# EAGLE design Adapter-TenX-Direct (EAGLE 7.7.0)
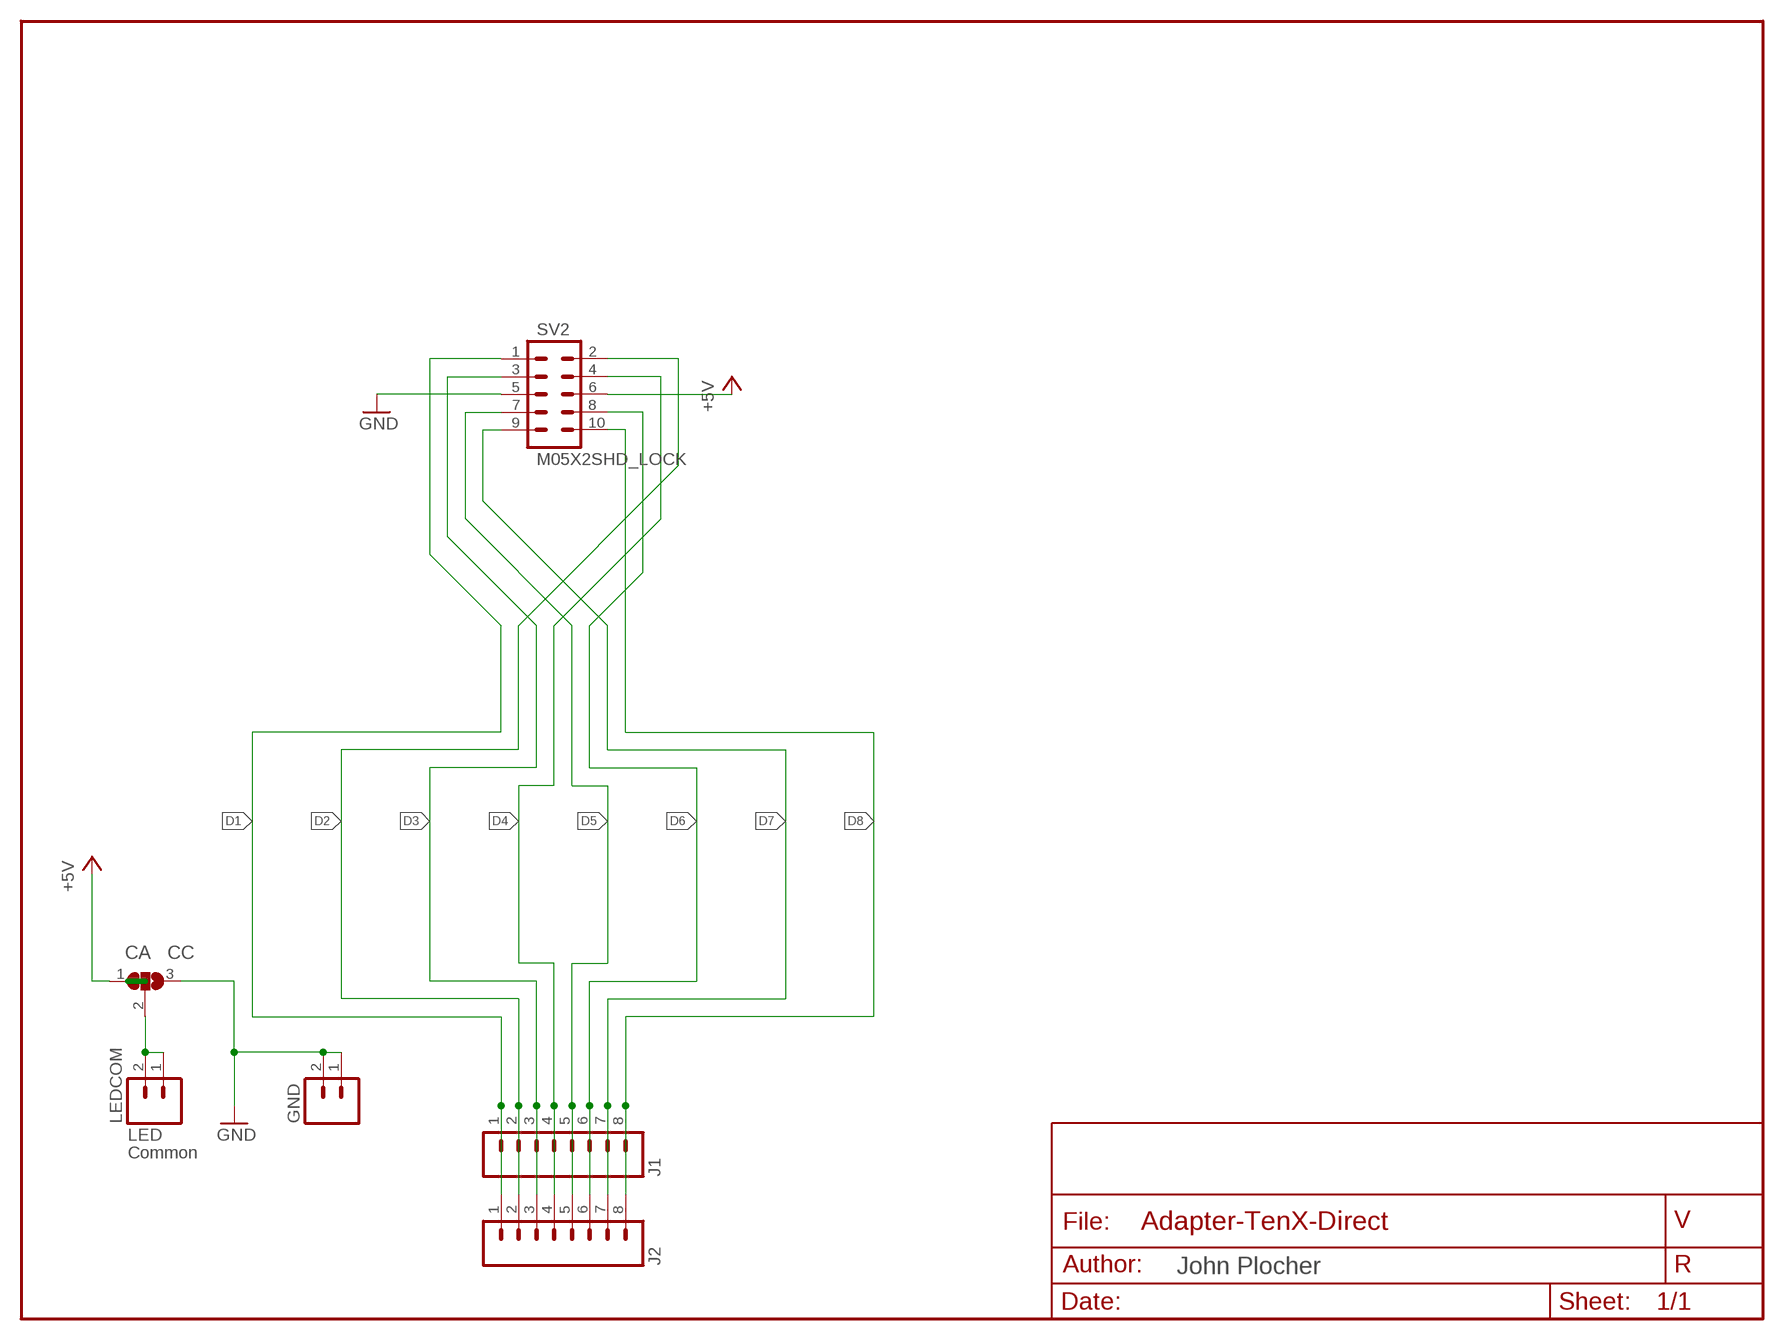
[diagram p0: schematic, sheet 1]

## Parts
GND  M02POLAR_LOCK  [MOLEX-1X2_LOCK]
J1  CONNECTOR-M08LOCK_LONGPADS  [1X08_LOCK_LONGPADS]
J2  CONNECTOR-M081.56-M  [KK-156-8-M]
LEDCOM  M02POLAR_LOCK  [MOLEX-1X2_LOCK]
P1  CA CC  PAD-SOLDERJUMPER-2WAYT  [3P-SMD-2X4.8]
SV2  M05X2SHD_LOCK  [2X5-SHROUDED_LOCK]

## Nets
+5V: P1.1 SV2.6
D1: J1.1 J2.1 SV2.1
D2: J1.2 J2.2 SV2.2
D3: J1.3 J2.3 SV2.3
D4: J1.4 J2.4 SV2.4
D5: J1.5 J2.5 SV2.7
D6: J1.6 J2.6 SV2.8
D7: J1.7 J2.7 SV2.9
D8: J1.8 J2.8 SV2.10
GND: GND.1 GND.2 P1.3 SV2.5
N$45: LEDCOM.1 LEDCOM.2 P1.2

## Notes on the sheet
- LED
- Common

## Library data of the parts
GND LEDCOM = SparkFun:M02: Header 2 Standard 2-pin 0.1" header. Use with straight break away headers (SKU : PRT-00116), right angle break away headers (PRT-00553), swiss pins (PRT-00743), machine pins (PRT-00117), and female headers (PRT-00115). Molex polarized connector foot print use with SKU : PRT-08233 with associated crimp pins and housings.
J1 J2 = SPCoast:CONNECTOR-M08: Header 8 Standard 8-pin 0.1" header. Use with straight break away headers (SKU : PRT-00116), right angle break away headers (PRT-00553), swiss pins (PRT-00743), machine pins (PRT-00117), and female headers (PRT-00115).
P1 = Discreter:PAD-SOLDERJUMPER-2WAY: Solder Jumper 2 way solder jumper
SV2 = SPCoast:M05X2: Header 5x2 Standard 10-pin dual row 0.1" header. Commonly used with AVR-ISP. Use with Spark Fun Electronics SKU: PRT-00778

## Board
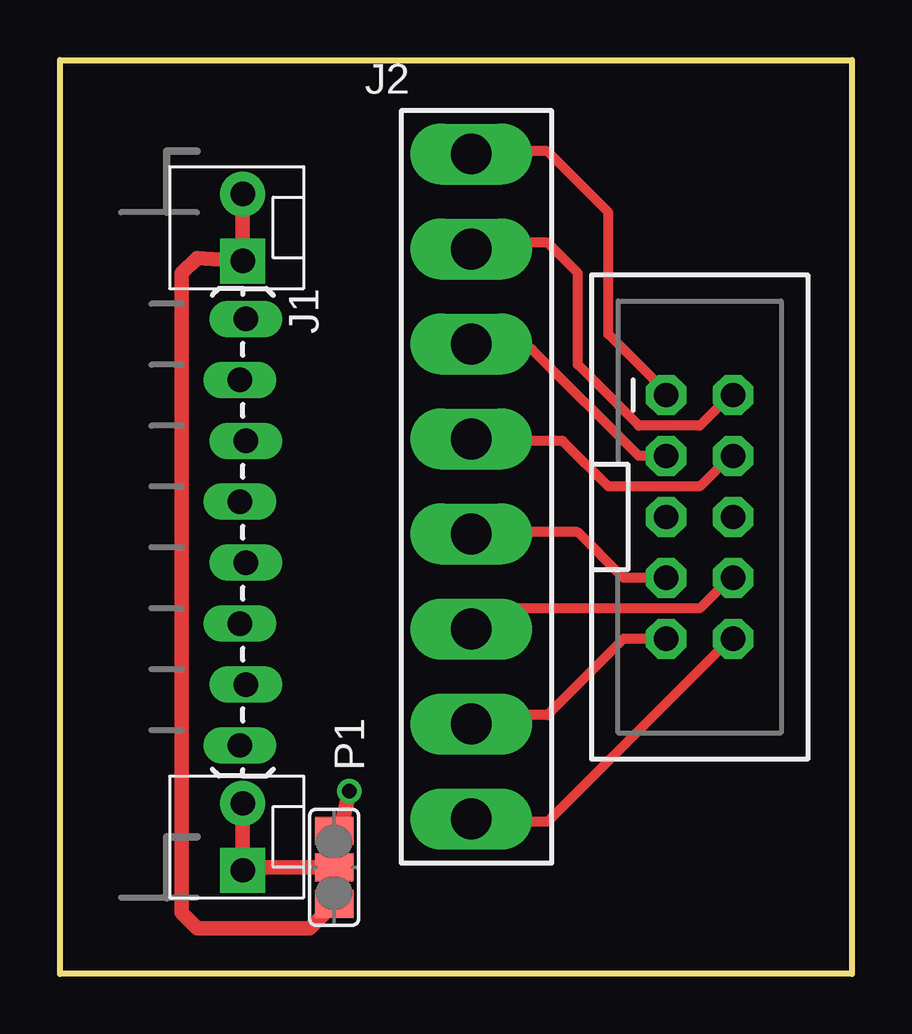
[diagram p1: board, top side]
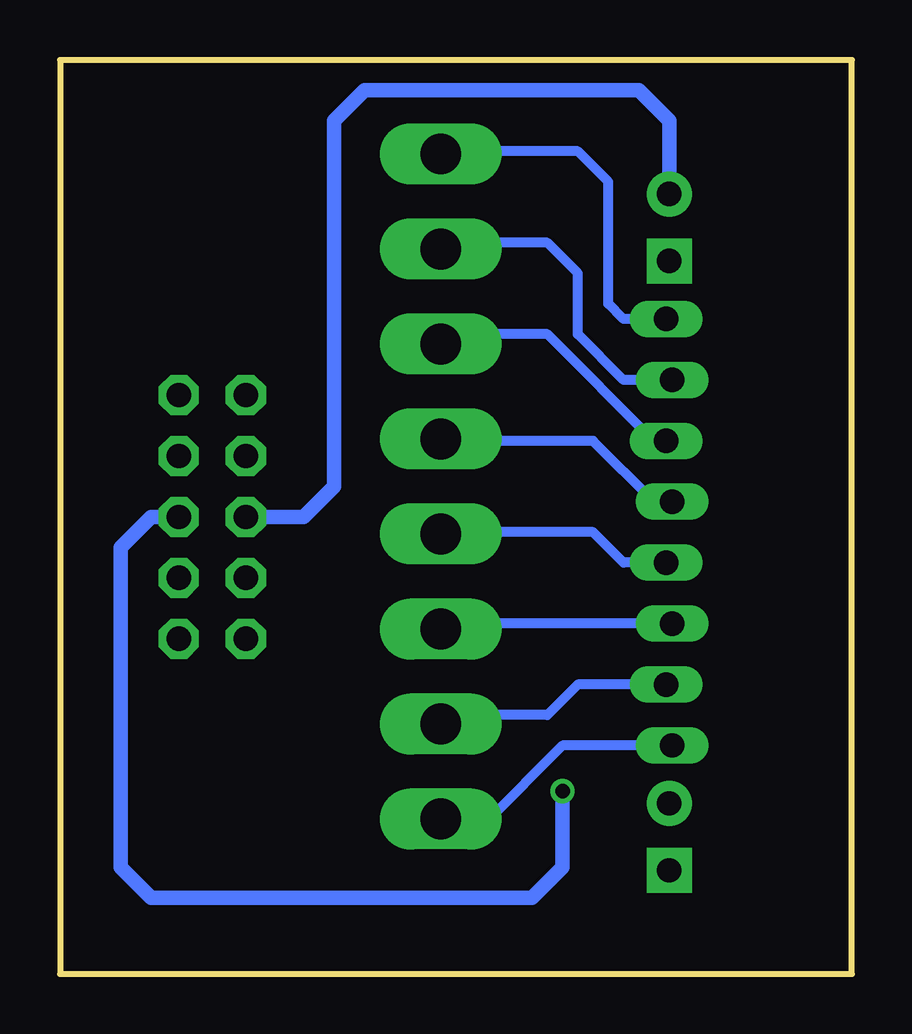
[diagram p2: board, bottom side, seen from below]

Size 33.02 x 38.1 mm. Coordinates in mm from the lower left corner, seen from the top.
Outline: 0,0 0,38.1 33.02,38.1 33.02,0 0,0
Copper layers (1*16): Top 0.035mm / dielectric 1.5mm / Bottom 0.035mm
Design rules "default": minimum track width 10mil, minimum drill 0.6mm, track to track 8mil, track to pad 8mil, pad to pad 8mil, via to via 8mil, smd to smd 8mil, copper to edge 40mil, drill to drill 8mil, minimum pad ring 10mil, minimum via ring 8mil, stop-mask expansion 4mil, vias tented up to drill 0mil, thermal gap 10mil

### Footprints (pad centres in the part's own frame; a part is rotated, then mirrored left to right if it is on the bottom)
MOLEX-1X2_LOCK = drill 1.016 pad 1.88 square: 1 -0.127,0 | drill 1.016 pad 1.88: 2 2.667,0
1X08_LOCK_LONGPADS = drill 1.016 long: 1 0,0.127; 2 2.54,-0.127; 3 5.08,0.127; 4 7.62,-0.127; 5 10.16,0.127; 6 12.7,-0.127; 7 15.24,0.127; 8 17.78,-0.127
KK-156-8-M = drill 1.7 pad 2.184 long: 1 -13.86,0; 2 -9.9,0; 3 -5.94,0; 4 -1.98,0; 5 1.98,0; 6 5.94,0; 7 9.9,0; 8 13.86,0
3P-SMD-2X4.8 = smd 1.168 x 1.6: 1 -1.524,0; 2 0,0; 3 1.524,0
2X5-SHROUDED_LOCK = drill 1.016 pad 1.676 octagon: 1 -1.397,5.08; 2 1.397,5.08; 3 -1.397,2.54; 4 1.397,2.54; 5 -1.397,0; 6 1.397,0; 7 -1.397,-2.54; 8 1.397,-2.54; 9 -1.397,-5.08; 10 1.397,-5.08

### Placement (x,y rotation side)
GND  7.62,29.84 90 top
J1  7.62,27.3 270 top
J2  17.14,20.32 270 top
LEDCOM  7.62,4.45 90 top
P1  11.43,4.45 270 top
SV2  26.67,19.05 0 top

### Tracks (layer width: path | path; a pad name or v marks a point on that pad's centre or on a via)
+5V  (via drill 0.6)
  Top 0.61: v12.06,7.62 11.68,5.97 P1.1
  Bottom 0.61: v12.06,7.62 12.06,4.45 13.34,3.17 29.21,3.17 30.48,4.45 30.48,17.78 29.21,19.05 SV2.6
D1
  Top 0.406: J2.1 16.62,34.29 20.32,34.29 22.86,31.75 22.86,26.67 25.27,24.26 SV2.1
  Bottom 0.406: J1.1 9.53,27.3 10.16,27.94 10.16,33.02 11.43,34.29 16.4,34.29 J2.1
D2
  Top 0.406: J2.2 16.77,30.48 20.32,30.48 21.59,29.21 21.59,25.4 24.13,22.86 26.67,22.86 27.94,24.13 SV2.2
  Bottom 0.406: J1.2 9.53,24.77 11.43,26.67 11.43,29.21 12.7,30.48 16.25,30.48 J2.2
D3
  Top 0.406: J2.3 16.73,26.04 19.68,26.04 24.13,21.59 SV2.3
  Bottom 0.406: J1.3 8.26,22.23 12.7,26.67 16.1,26.67 J2.3
D4
  Top 0.406: J2.4 16.59,22.23 20.95,22.23 22.86,20.32 26.67,20.32 27.94,21.59 SV2.4
  Bottom 0.406: J1.4 8.26,19.68 10.79,22.23 16.43,22.23 J2.4
D5
  Top 0.406: J2.5 16.59,18.41 21.59,18.41 23.5,16.51 SV2.7
  Bottom 0.406: J1.5 9.53,17.14 10.79,18.41 16.43,18.41 J2.5
D6
  Top 0.406: J2.6 17.37,15.24 26.67,15.24 27.94,16.51 SV2.8
  Bottom 0.406: J1.6 16.29,14.61 J2.6
D7
  Top 0.406: J2.7 16.89,10.79 20.32,10.79 23.5,13.97 SV2.9
  Bottom 0.406: J1.7 11.43,12.06 12.7,10.79 16.14,10.79 J2.7
D8
  Top 0.406: J2.8 16.62,6.35 20.32,6.35 27.94,13.97 SV2.10
  Bottom 0.406: J1.8 12.06,9.53 15.24,6.35 16.4,6.35 J2.8
GND
  Top 0.61: GND.2 GND.1 5.71,29.84 5.08,29.21 5.08,2.54 5.71,1.91 10.41,1.91 P1.3
  Bottom 0.61: SV2.5 22.86,19.05 21.59,20.32 21.59,35.56 20.32,36.83 8.89,36.83 7.62,35.56 GND.2
N$45
  Top 0.61: LEDCOM.2 7.62,4.45 | 7.62,4.45 LEDCOM.1 | P1.2 7.62,4.45

### Text on the board
tDocu: WH | GND | v1.0 | MRCS | D1 | D2 | D3 | D4 | D5 | D6 | D7 | D8 | LED | Com | CC CA